# EasyEDA Pro project Wemos Board.eprj

# Schematic Wemos Board
Create Date: 2023-09-14; Page Name: P1; Project Name: Wemos Board; Schematic Name: Wemos Board; Update Date: 2023-09-14; Company: Joshua Ifeanyi Okonkwo; Page Size: A4; Part Number: JLCPCB-002; Reviewed: EasyEDA Pro; Version: V0.1
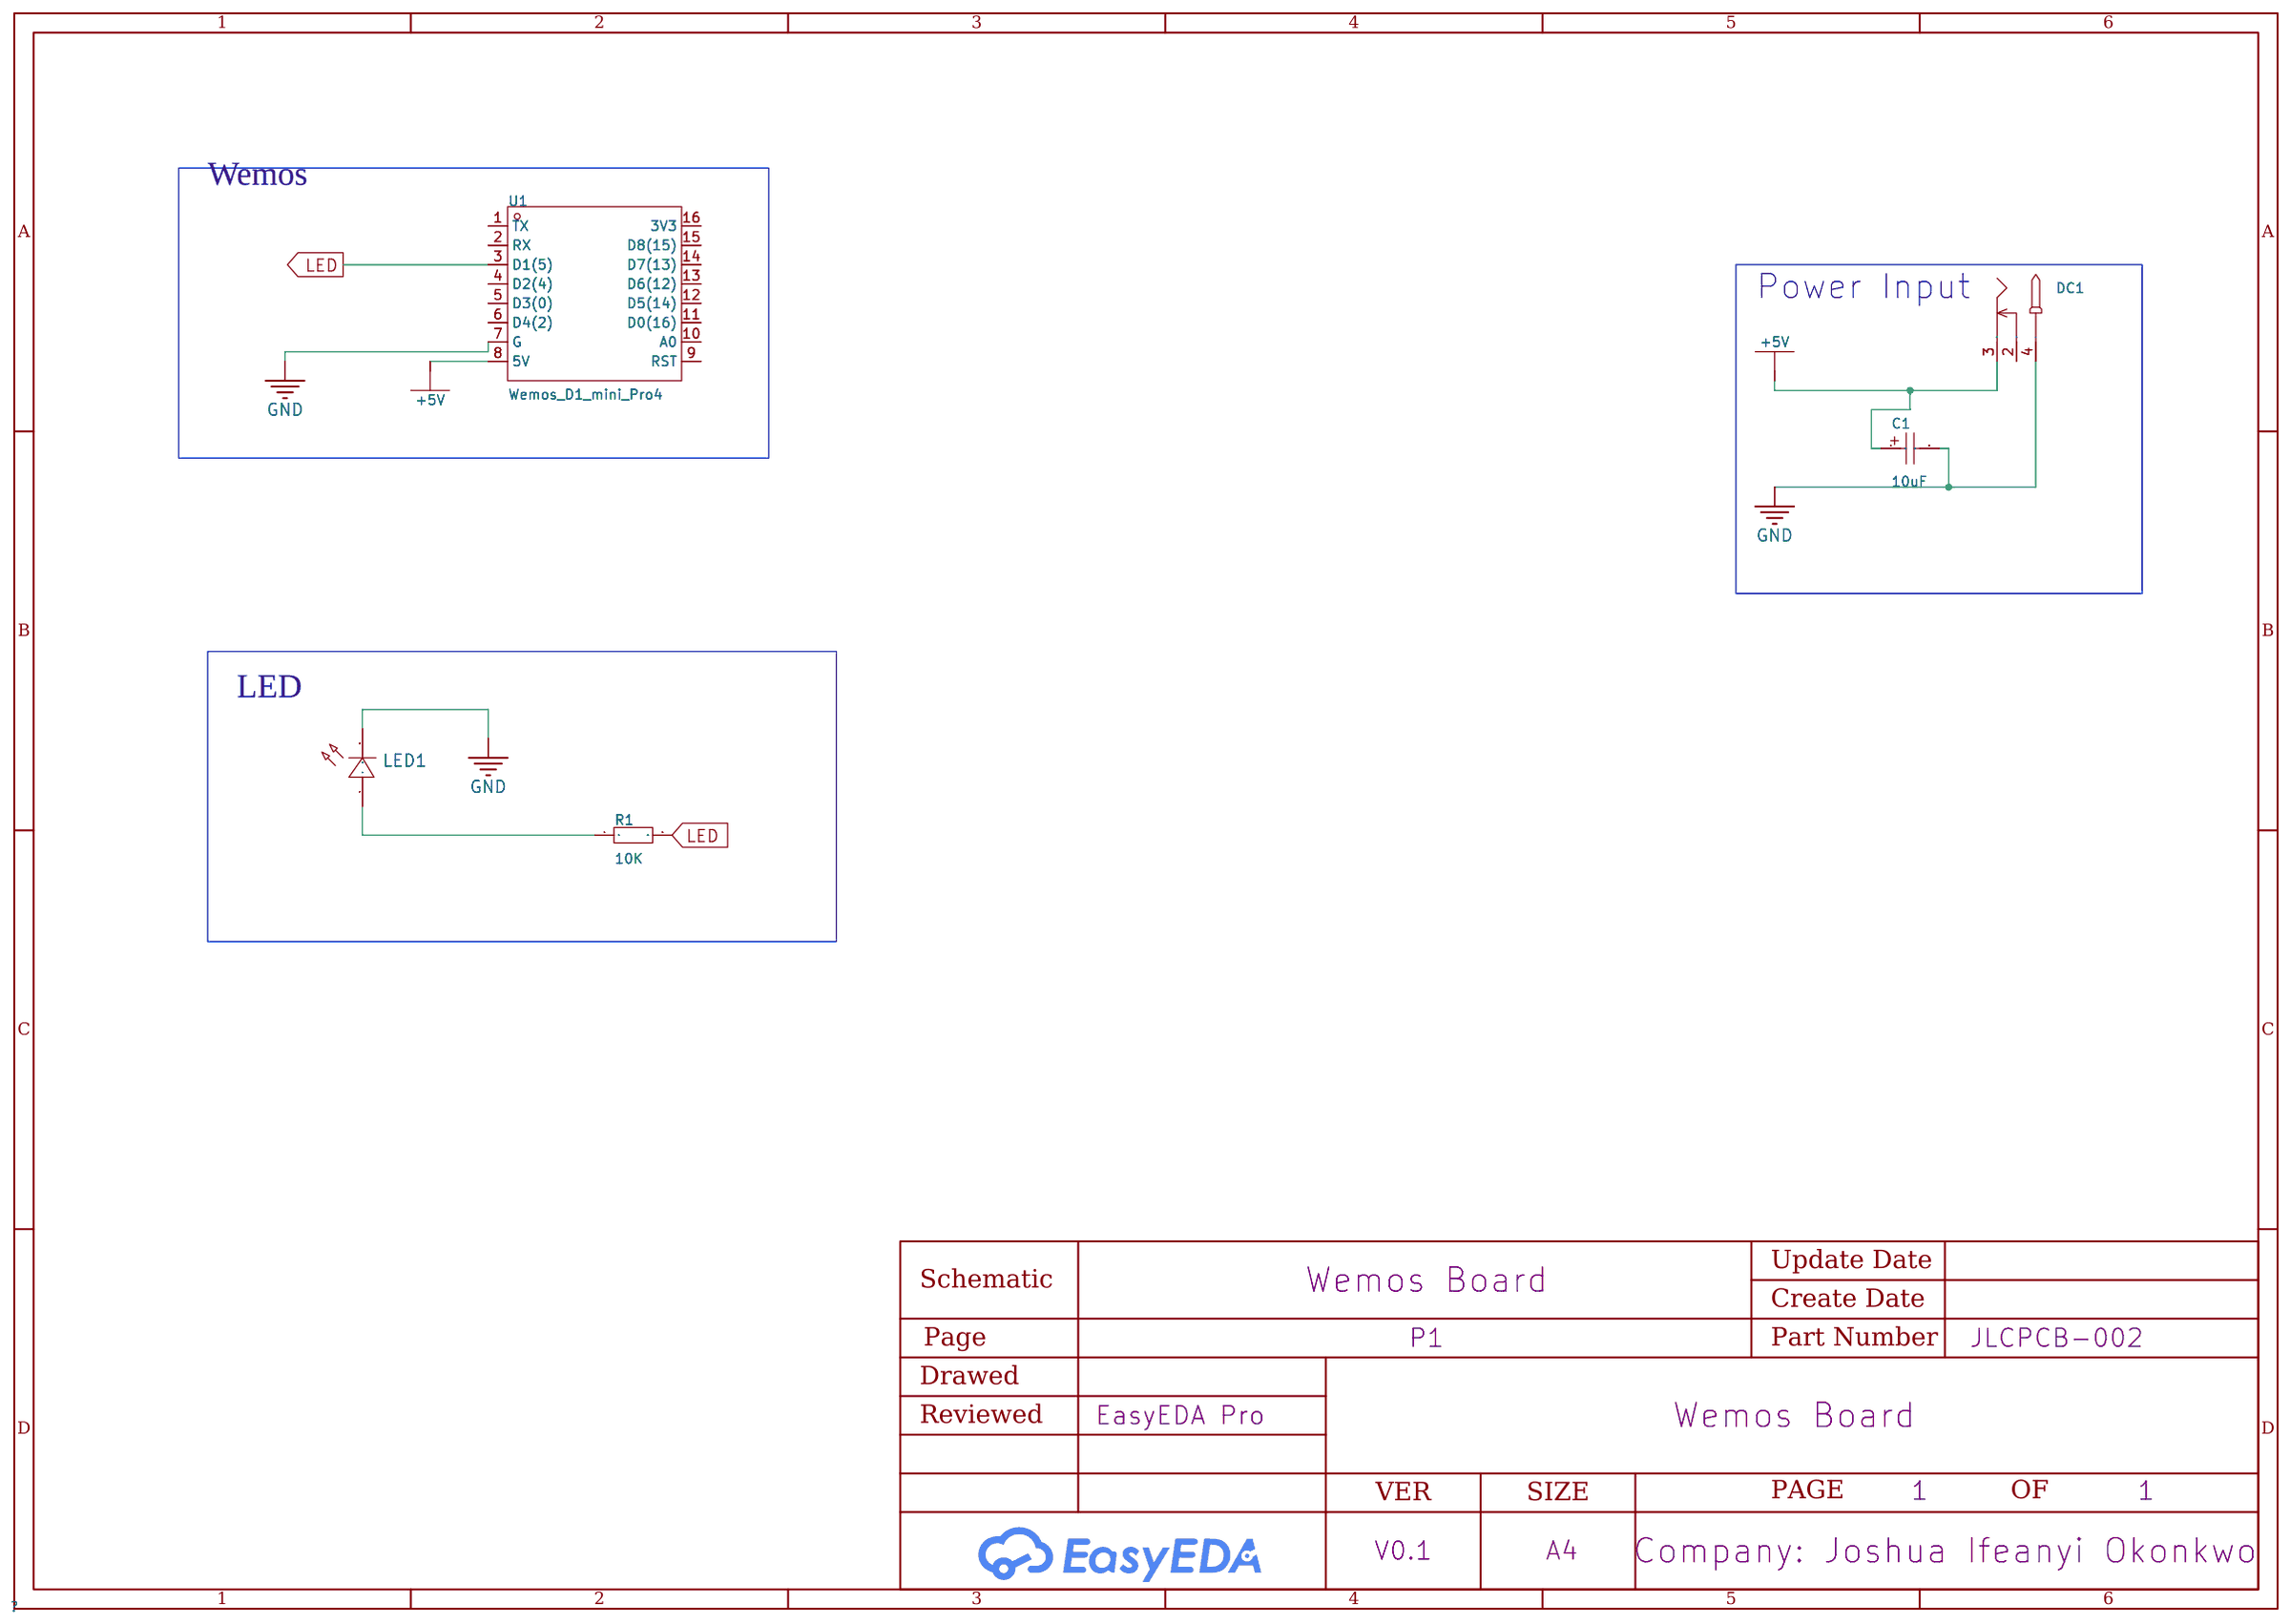
[diagram p0: schematic sheet]

## Parts
C1  10uF  [CAP-SMD_BD3.0-L3.3-W3.3-RD]
DC1  -  [DC-IN-TH_DC-5520-1]
LED1  -  [LED0402-RD_YELLOW]
R1  10K  [R0201]
U1  Wemos_D1_mini_Pro4  [DIP-16_WEMOS_D1_MINI_PRO4]

## Library data of the parts
C1 = C_Ele_SMD_3x5.4mm: Supplier Footprint: SMD,3x5.4mm
DC1 = DC-005_2.0: Supplier Footprint: Through
LED1 = LED_0402-R: Supplier Footprint: 0402
R1 = Res_0201: Supplier Footprint: 0201
U1 = Wemos_D1_mini_Pro4: Supplier Part: C2837266; Supplier Footprint: DIP-16; JLCPCB Part Class: Extended Part; Datasheet: 2021-05-28/701891G/4a5f3d7375be42cf8ff787d5d0ef922d/mini_D1_PRO.pdf; Supplier: LCSC

## Nets
+5V: C1.1 DC1.3 U1.8(5V)
GND: C1.2 DC1.4 LED1.2(C) U1.7(G)
LED: R1.2 U1.3(D1(5))
$1N772: LED1.1(A) R1.1

Not connected (* = marked no-connect by the designer): DC1 2; U1 1(TX) 2(RX) 4(D2(4)) 5(D3(0)) 6(D4(2)) 9(RST) 10(A0) 11(D0(16)) 12(D5(14)) 13(D6(12)) 14(D7(13)) 15(D8(15)) 16(3V3)

## Notes on the sheet
- Wemos
- Power Input
- LED

# Board PCB1
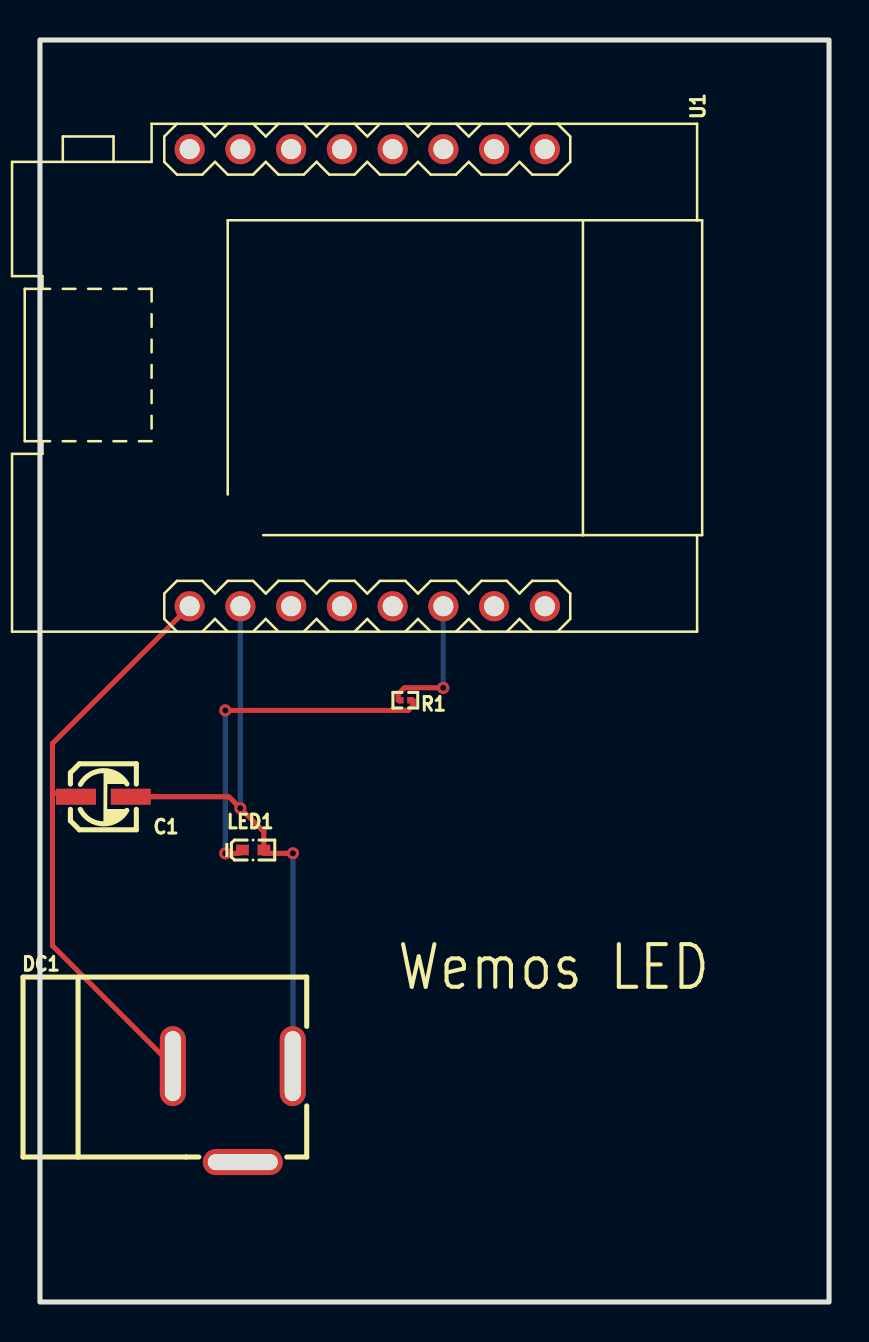
[diagram p1: board, top side]
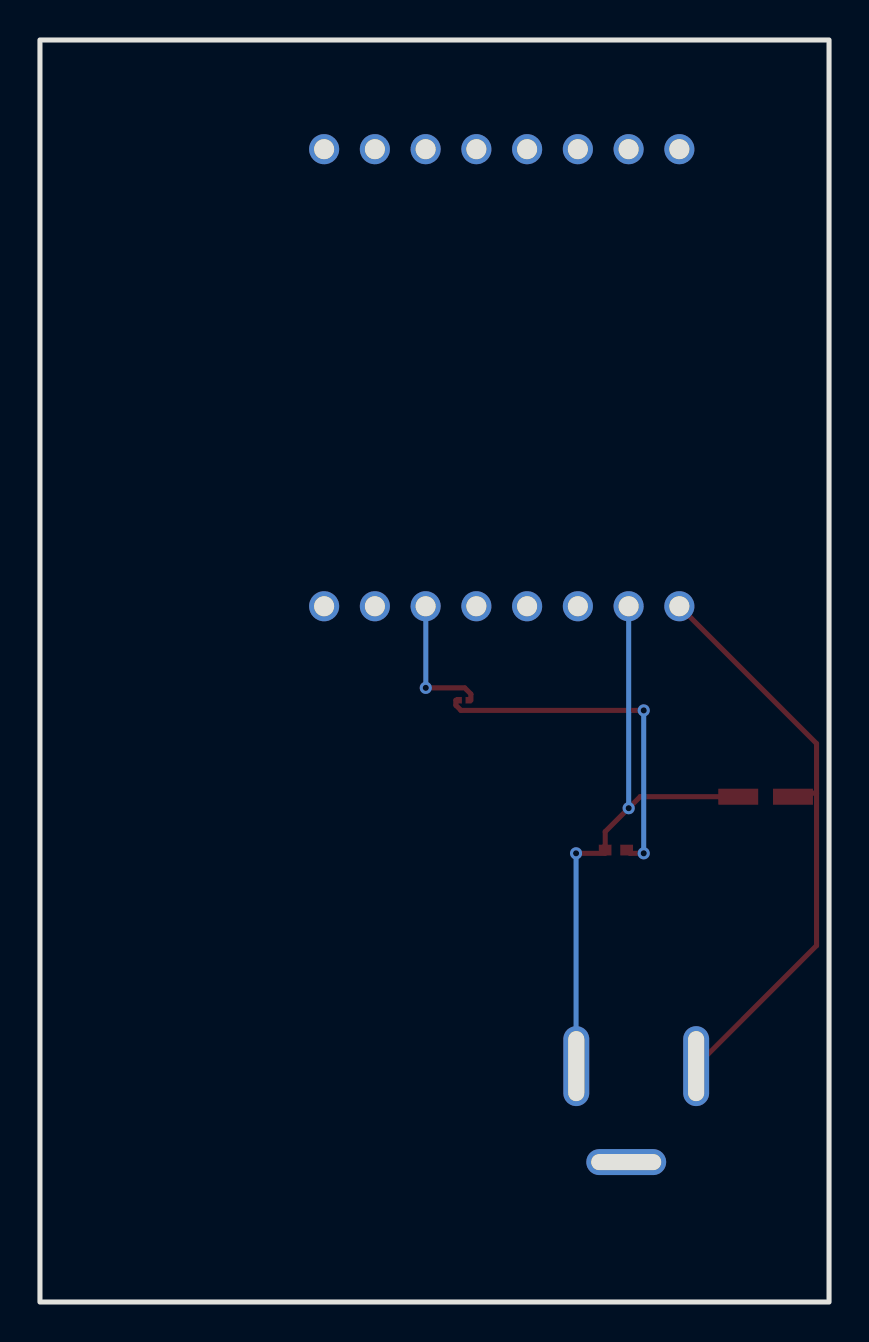
[diagram p2: board, bottom side, seen from below]

Outline 39.5 x 63.12 mm; copper layers: Top Layer, Bottom Layer. Coordinates in mm from the lower left corner of the outline.
Outline path: rectangle 0,63.12 39.5,0
Stack: Top Layer 0.035mm / Dielectric1 1.51mm FR4 er 4.5 / Bottom Layer 0.035mm

## Design rules (mm)
template: JLCPCB Capability(Two Layers Board)
spacing copperThickness1oz (default): track to track 0.102, other pairs 0.152 to 0.3
spacing copperThickness2oz: track to track 0.203, other pairs 0.152 to 0.3
track width copperThickness1oz (default): min 0.127, default 0.254, max 2.54
track width copperThickness2oz: min 0.203, default 0.254, max 2.54
differential pair differentialPair (default): width min 0.127, default 0.254, max 2.54; gap min 0.152, default 0.152
via viaSize (default): diameter min 0.5, default 0.61, max 10; hole min 0.3, default 0.305, max 6.3

## Placement (name value [footprint] x y rotation side)
C1  10uF  [CAP-SMD_BD3.0-L3.3-W3.3-RD]  3.18 25.27 180 top
DC1  -  [DC-IN-TH_DC-5520-1]  9.65 9.4 0 top
LED1  -  [LED0402-RD_YELLOW]  10.67 22.61 0 top
R1  10K  [R0201]  18.29 30.1 180 top
U1  Wemos_D1_mini_Pro4  [DIP-16_WEMOS_D1_MINI_PRO4]  16.38 46.23 270 top

## Footprints (pads in the part's own frame, mm; a bottom-side part is the same pattern mirrored in y, then rotated)
CAP-SMD_BD3.0-L3.3-W3.3-RD
  rect 2x0.8 smd: 1(1.37,0) 2(-1.37,0)
DC-IN-TH_DC-5520-1
  oval 4x1.3 hole 3.5x0.8: 2(0.5,-2.4)
  oval 1.3x4 hole 0.8x3.5: 3(-3,2.4) 4(3,2.4)
DIP-16_WEMOS_D1_MINI_PRO4
  round 1.508 hole 1x1: 1(11.43,8.89) 2(11.43,6.35) 3(11.43,3.81) 4(11.43,1.27) 5(11.43,-1.27) 6(11.43,-3.81) 7(11.43,-6.35) 8(11.43,-8.89) 9(-11.43,8.89) 10(-11.43,6.35) 11(-11.43,3.81) 12(-11.43,1.27) 13(-11.43,-1.27) 14(-11.43,-3.81) 15(-11.43,-6.35) 16(-11.43,-8.89)
LED0402-RD_YELLOW
  rect 0.636x0.54 smd: 1(-0.538,0) 2(0.538,0)
R0201
  rect 0.303x0.324 smd: 1(-0.241,0) 2(0.241,0)

## Nets
As in the schematic.

Pads without a net: DC1 2; U1 1 2 4 5 6 9 10 11 12 13 14 15 16

## Via types
v1: diameter 0.61, hole 0.305, Top Layer to Bottom Layer, 5 vias

## Routing (per net, layer and track width the routed paths; a pad name or vN(x,y) marks a point on that pad's centre or on a via; arc(x,y) is an arc through that point)
+5V: length 29.6
  Top Layer w0.254: C1.1 1.63,25.45 0.63,25.45 ; 0.63,25.45 0.63,27.93 U1.8 ; 0.63,25.45 0.63,17.83 6.65,11.8
GND: length 30.7
  Top Layer w0.254: v1(12.66,22.44) 11.21,22.44 11.21,23.52 v1(10.03,24.7) 9.45,25.27 C1.2
  Bottom Layer w0.254: 12.65,11.8 12.66,11.81 v1(12.66,22.44) ; v1(10.03,24.7) 10.03,34.79 U1.7
LED: length 6.9
  Top Layer w0.254: R1.2 17.93,30.1 17.93,30.41 18.24,30.72 v1(20.19,30.72)
  Bottom Layer w0.254: U1.3 20.19,34.79 v1(20.19,30.72)
$1N772: length 18
  Top Layer w0.254: R1.1 18.68,30.1 18.68,29.84 18.43,29.59 v1(9.28,29.59) ; LED1.1 9.97,22.44 v1(9.28,22.44)
  Bottom Layer w0.254: v1(9.28,29.59) v1(9.28,22.44)

## Text on the board
Top Silkscreen Layer: Wemos LED
